# EAGLE board toyotune_3s_lvc (EAGLE 5.11)
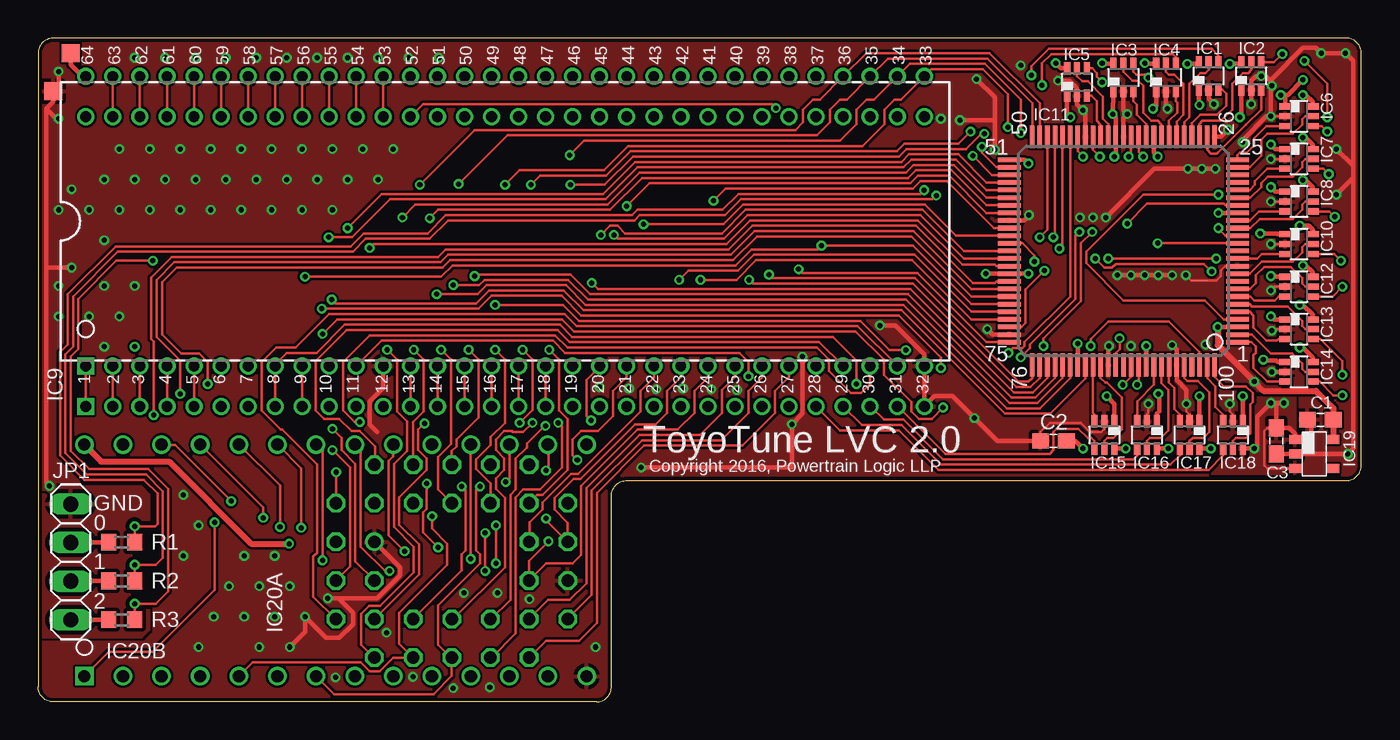
[diagram p4: board, top side]
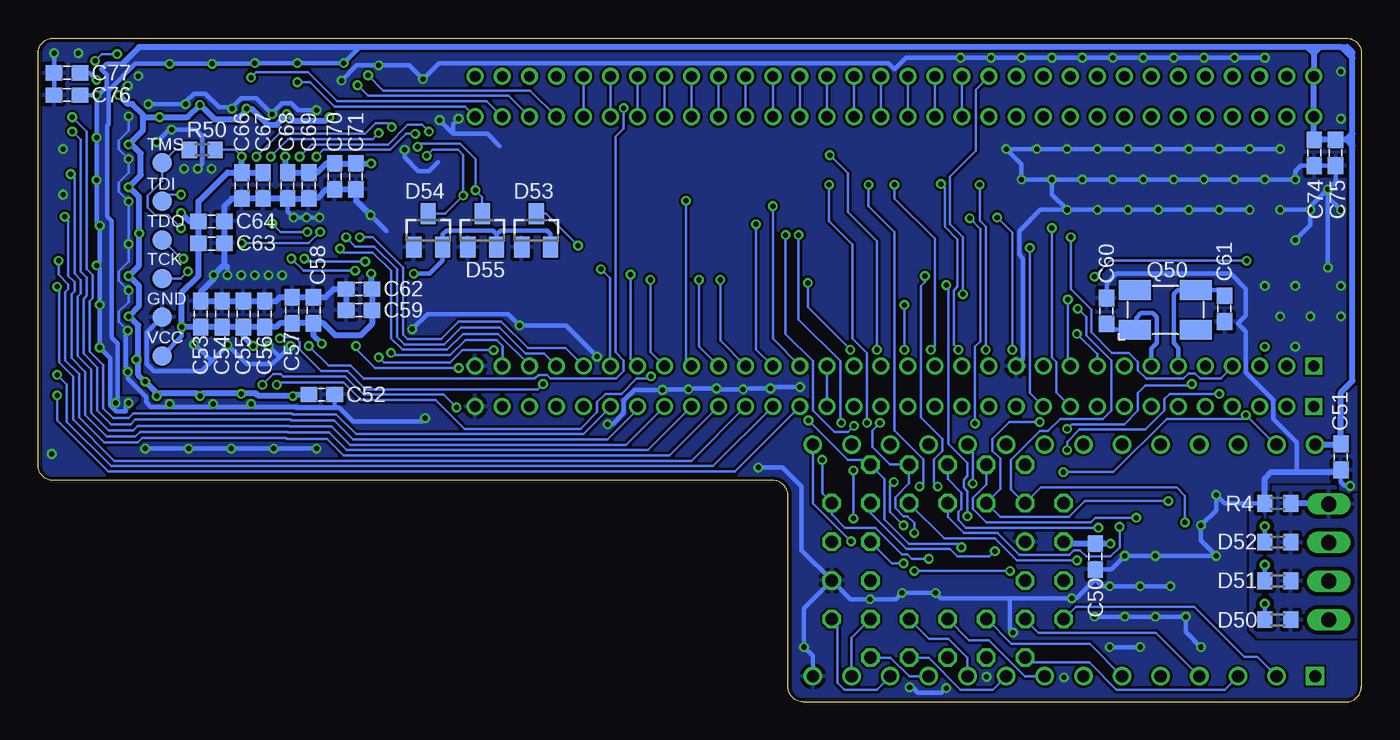
[diagram p5: board, bottom side, seen from below]

Size 87 x 43.65 mm. Coordinates in mm from the lower left corner, seen from the top.
Outline: 1.05,43.65 arc90 0,42.65 0,1 arc90 1,0 36.7,0 arc90 37.7,1 37.7,13.55 arc-90 38.7,14.55 86,14.55 arc90 87,15.55 87,42.65 arc90 86,43.65 1.05,43.65
Copper layers (1*16): Top 0.035mm / dielectric 1.5mm / Bottom 0.035mm
Design rules "pcbway": minimum track width 6mil, minimum drill 12mil, track to track 6mil, track to pad 6mil, pad to pad 6mil, via to via 6mil, smd to smd 0mil, copper to edge 10mil, drill to drill 10mil, minimum pad ring 8mil, minimum via ring 6mil, stop-mask expansion 2mil, vias tented up to drill 100mil, thermal gap 10mil

## Footprints (pad centres in the part's own frame; a part is rotated, then mirrored left to right if it is on the bottom)
C0603 = smd 1.1 x 1: 1 -0.85,0; 2 0.85,0
R0603 = smd 1 x 1.1: 1 -0.85,0; 2 0.85,0
SOT23 = smd 1 x 1.4: 1 -0.95,-1.1; 2 0.95,-1.1; 3 0,1.1
DCK_R-PDSO-G6 = smd 0.4 x 0.8: 1 -0.65,-0.9; 2 0,-0.9; 3 0.65,-0.9; 4 0.65,0.9; 5 0,0.9; 6 -0.65,0.9
SDIP-64 = drill 0.711 square: 1 -27.559,-9.525 | drill 0.711 round: 2 -25.781,-9.525; 3 -24.003,-9.525; 4 -22.225,-9.525; 5 -20.447,-9.525; 6 -18.669,-9.525; 7 -16.891,-9.525; 8 -15.113,-9.525; 9 -13.335,-9.525; 10 -11.557,-9.525; 11 -9.779,-9.525; 12 -8.001,-9.525; 13 -6.223,-9.525; 14 -4.445,-9.525; 15 -2.667,-9.525; 16 -0.889,-9.525; 17 0.889,-9.525; 18 2.667,-9.525; 19 4.445,-9.525; 20 6.223,-9.525; 21 8.001,-9.525; 22 9.779,-9.525; 23 11.557,-9.525; 24 13.335,-9.525; 25 15.113,-9.525; 26 16.891,-9.525; 27 18.669,-9.525; 28 20.447,-9.525; 29 22.225,-9.525; 30 24.003,-9.525; 31 25.781,-9.525; 32 27.559,-9.525; 33 27.559,9.525; 34 25.781,9.525; 35 24.003,9.525; 36 22.225,9.525; 37 20.447,9.525; 38 18.669,9.525; 39 16.891,9.525; 40 15.113,9.525; 41 13.335,9.525; 42 11.557,9.525; 43 9.779,9.525; 44 8.001,9.525; 45 6.223,9.525; 46 4.445,9.525; 47 2.667,9.525; 48 0.889,9.525; 49 -0.889,9.525; 50 -2.667,9.525; 51 -4.445,9.525; 52 -6.223,9.525; 53 -8.001,9.525; 54 -9.779,9.525; 55 -11.557,9.525; 56 -13.335,9.525; 57 -15.113,9.525; 58 -16.891,9.525; 59 -18.669,9.525; 60 -20.447,9.525; 61 -22.225,9.525; 62 -24.003,9.525; 63 -25.781,9.525; 64 -27.559,9.525
VQ100 = smd 1.5 x 0.3: 1 -7.5,6; 2 -7.5,5.5; 3 -7.5,5; 4 -7.5,4.5; 5 -7.5,4; 6 -7.5,3.5; 7 -7.5,3; 8 -7.5,2.5; 9 -7.5,2; 10 -7.5,1.5; 11 -7.5,1; 12 -7.5,0.5; 13 -7.5,0; 14 -7.5,-0.5; 15 -7.5,-1; 16 -7.5,-1.5; 17 -7.5,-2; 18 -7.5,-2.5; 19 -7.5,-3; 20 -7.5,-3.5; 21 -7.5,-4; 22 -7.5,-4.5; 23 -7.5,-5; 24 -7.5,-5.5; 25 -7.5,-6; 51 7.5,-6; 52 7.5,-5.5; 53 7.5,-5; 54 7.5,-4.5; 55 7.5,-4; 56 7.5,-3.5; 57 7.5,-3; 58 7.5,-2.5; 59 7.5,-2; 60 7.5,-1.5; 61 7.5,-1; 62 7.5,-0.5; 63 7.5,0; 64 7.5,0.5; 65 7.5,1; 66 7.5,1.5; 67 7.5,2; 68 7.5,2.5; 69 7.5,3; 70 7.5,3.5; 71 7.5,4; 72 7.5,4.5; 73 7.5,5; 74 7.5,5.5; 75 7.5,6 | smd 0.3 x 1.5: 26 -6,-7.5; 27 -5.5,-7.5; 28 -5,-7.5; 29 -4.5,-7.5; 30 -4,-7.5; 31 -3.5,-7.5; 32 -3,-7.5; 33 -2.5,-7.5; 34 -2,-7.5; 35 -1.5,-7.5; 36 -1,-7.5; 37 -0.5,-7.5; 38 0,-7.5; 39 0.5,-7.5; 40 1,-7.5; 41 1.5,-7.5; 42 2,-7.5; 43 2.5,-7.5; 44 3,-7.5; 45 3.5,-7.5; 46 4,-7.5; 47 4.5,-7.5; 48 5,-7.5; 49 5.5,-7.5; 50 6,-7.5; 76 6,7.5; 77 5.5,7.5; 78 5,7.5; 79 4.5,7.5; 80 4,7.5; 81 3.5,7.5; 82 3,7.5; 83 2.5,7.5; 84 2,7.5; 85 1.5,7.5; 86 1,7.5; 87 0.5,7.5; 88 0,7.5; 89 -0.5,7.5; 90 -1,7.5; 91 -1.5,7.5; 92 -2,7.5; 93 -2.5,7.5; 94 -3,7.5; 95 -3.5,7.5; 96 -4,7.5; 97 -4.5,7.5; 98 -5,7.5; 99 -5.5,7.5; 100 -6,7.5
DDC_R-PDSO-G5 = smd 0.6 x 0.8: 1 -0.95,-1.25; 2 0,-1.25; 3 0.95,-1.25; 4 0.95,1.25; 5 -0.95,1.25
S32 = drill 0.813 round: 1 1.27,5.08 | drill 0.813 octagon: 2 -1.27,7.62; 3 -1.27,5.08; 4 -3.81,7.62; 5 -6.35,5.08; 6 -3.81,5.08; 7 -6.35,2.54; 8 -3.81,2.54; 9 -6.35,0; 10 -3.81,0; 11 -6.35,-2.54; 12 -3.81,-2.54; 13 -6.35,-5.08; 14 -3.81,-7.62; 15 -3.81,-5.08; 16 -1.27,-7.62; 17 -1.27,-5.08; 18 1.27,-7.62; 19 1.27,-5.08; 20 3.81,-7.62; 21 6.35,-5.08; 22 3.81,-5.08; 23 6.35,-2.54; 24 3.81,-2.54; 25 6.35,0; 26 3.81,0; 27 6.35,2.54; 28 3.81,2.54; 29 6.35,5.08; 30 3.81,7.62; 31 3.81,5.08; 32 1.27,7.62
PDIP28 = drill 0.813 square: 1 -16.51,-7.62 | drill 0.813 round: 2 -13.97,-7.62; 3 -11.43,-7.62; 4 -8.89,-7.62; 5 -6.35,-7.62; 6 -3.81,-7.62; 7 -1.27,-7.62; 8 1.27,-7.62; 9 3.81,-7.62; 10 6.35,-7.62; 11 8.89,-7.62; 12 11.43,-7.62; 13 13.97,-7.62; 14 16.51,-7.62; 15 16.51,7.62; 16 13.97,7.62; 17 11.43,7.62; 18 8.89,7.62; 19 6.35,7.62; 20 3.81,7.62; 21 1.27,7.62; 22 -1.27,7.62; 23 -3.81,7.62; 24 -6.35,7.62; 25 -8.89,7.62; 26 -11.43,7.62; 27 -13.97,7.62; 28 -16.51,7.62
1X04 = drill 1.016 long: 1 -3.81,0; 2 -1.27,0; 3 1.27,0; 4 3.81,0
1X06_SMD = smd 1.27 x 1.27: GND 3.81,0; TCK 1.27,0; TDI -3.81,0; TDO -1.27,0; TMS -6.35,0; VCC 6.35,0
CRYSTAL-SMD-5X3 = smd 2.1 x 1.3: 1 -2,-1.3; 2 2,-1.3; 3 2,1.3; 4 -2,1.3
TP12SQ = smd 1.2 x 1.2: TP 0,0
SDIP-64-CONN = drill 0.711 square: 1 -27.559,-9.525 | drill 0.711 round: 2 -25.781,-9.525; 3 -24.003,-9.525; 4 -22.225,-9.525; 5 -20.447,-9.525; 6 -18.669,-9.525; 7 -16.891,-9.525; 8 -15.113,-9.525; 9 -13.335,-9.525; 10 -11.557,-9.525; 11 -9.779,-9.525; 12 -8.001,-9.525; 13 -6.223,-9.525; 14 -4.445,-9.525; 15 -2.667,-9.525; 16 -0.889,-9.525; 17 0.889,-9.525; 18 2.667,-9.525; 19 4.445,-9.525; 20 6.223,-9.525; 21 8.001,-9.525; 22 9.779,-9.525; 23 11.557,-9.525; 24 13.335,-9.525; 25 15.113,-9.525; 26 16.891,-9.525; 27 18.669,-9.525; 28 20.447,-9.525; 29 22.225,-9.525; 30 24.003,-9.525; 31 25.781,-9.525; 32 27.559,-9.525; 33 27.559,9.525; 34 25.781,9.525; 35 24.003,9.525; 36 22.225,9.525; 37 20.447,9.525; 38 18.669,9.525; 39 16.891,9.525; 40 15.113,9.525; 41 13.335,9.525; 42 11.557,9.525; 43 9.779,9.525; 44 8.001,9.525; 45 6.223,9.525; 46 4.445,9.525; 47 2.667,9.525; 48 0.889,9.525; 49 -0.889,9.525; 50 -2.667,9.525; 51 -4.445,9.525; 52 -6.223,9.525; 53 -8.001,9.525; 54 -9.779,9.525; 55 -11.557,9.525; 56 -13.335,9.525; 57 -15.113,9.525; 58 -16.891,9.525; 59 -18.669,9.525; 60 -20.447,9.525; 61 -22.225,9.525; 62 -24.003,9.525; 63 -25.781,9.525; 64 -27.559,9.525

## Placement (x,y rotation side)
C1  1uF  [C0603]  84.3,18.55 180 top
C2  0.1uF  [C0603]  66.75,17.15 0 top
C3  1uF  [C0603]  81.4,17.15 270 top
C50  0.1uF  [C0603]  17.5,9.55 90 bottom
C51  0.1uF  [C0603]  1.35,16.1 90 bottom
C52  0.1uF  [C0603]  68.35,20.2 180 bottom
C53  0.01uF  [C0603]  76.3,25.5 270 bottom
C54  0.1uF  [C0603]  74.9,25.5 270 bottom
C55  0.01uF  [C0603]  73.5,25.5 270 bottom
C56  0.1uF  [C0603]  72.1,25.5 270 bottom
C57  0.1uF  [C0603]  70.3,25.75 270 bottom
C58  0.01uF  [C0603]  68.9,25.75 270 bottom
C59  0.1uF  [C0603]  65.9,25.75 0 bottom
C60  10pF  [C0603]  16.75,25.7 90 bottom
C61  10pF  [C0603]  9,25.85 90 bottom
C62  0.01uF  [C0603]  65.9,27.15 0 bottom
C63  0.1uF  [C0603]  75.6,30.15 180 bottom
C64  0.01uF  [C0603]  75.6,31.6 180 bottom
C66  0.01uF  [C0603]  73.6,33.95 90 bottom
C67  0.1uF  [C0603]  72.2,33.95 90 bottom
C68  0.01uF  [C0603]  70.6,33.95 90 bottom
C69  0.1uF  [C0603]  69.2,33.95 90 bottom
C70  0.1uF  [C0603]  67.5,34.55 90 bottom
C71  0.01uF  [C0603]  66.1,34.55 90 bottom
C74  0.01uF  [C0603]  3.1,36.1 90 bottom
C75  0.1uF  [C0603]  1.7,36.1 90 bottom
C76  0.1uF  [C0603]  85.1,39.9 0 bottom
C77  0.1uF  [C0603]  85.1,41.35 0 bottom
D50  PGB1010603  [R0603]  5.5,5.4 180 bottom
D51  PGB1010603  [R0603]  5.5,7.95 180 bottom
D52  PGB1010603  [R0603]  5.5,10.5 180 bottom
D53  BAT54S  [SOT23]  54.25,31 0 bottom
D54  BAT54S  [SOT23]  61.35,31 0 bottom
D55  BAT54S  [SOT23]  57.8,31 0 bottom
IC1  SN74LVC1T45DCK  [DCK_R-PDSO-G6]  76.95,41.15 0 top
IC2  SN74LVC1T45DCK  [DCK_R-PDSO-G6]  79.75,41.15 0 top
IC3  SN74LVC1T45DCK  [DCK_R-PDSO-G6]  71.35,41.05 0 top
IC4  SN74LVC1T45DCK  [DCK_R-PDSO-G6]  74.15,41.05 0 top
IC5  SN74LVC1T45DCK  [DCK_R-PDSO-G6]  68.3,40.75 0 top
IC6  SN74LVC1T45DCK  [DCK_R-PDSO-G6]  82.9,38.5 270 top
IC7  SN74LVC1T45DCK  [DCK_R-PDSO-G6]  82.9,35.7 270 top
IC8  SN74LVC1T45DCK  [DCK_R-PDSO-G6]  82.9,32.9 270 top
IC9  D15180X-XXXX  [SDIP-64]  30.7,31.6 0 top
IC10  SN74LVC1T45DCK  [DCK_R-PDSO-G6]  82.9,30.1 270 top
IC11  XCR3128XL  [VQ100]  71.35,29.65 180 top
IC12  SN74LVC1T45DCK  [DCK_R-PDSO-G6]  82.9,27.3 270 top
IC13  SN74LVC1T45DCK  [DCK_R-PDSO-G6]  82.9,24.5 270 top
IC14  SN74LVC1T45  [DCK_R-PDSO-G6]  82.9,21.7 270 top
IC15  SN74LVC1T45DCK  [DCK_R-PDSO-G6]  70.1,17.55 180 top
IC16  SN74LVC1T45DCK  [DCK_R-PDSO-G6]  72.9,17.55 180 top
IC17  SN74LVC1T45DCK  [DCK_R-PDSO-G6]  75.7,17.55 180 top
IC18  SN74LVC1T45DCK  [DCK_R-PDSO-G6]  78.55,17.55 180 top
IC19  TLV70033  [DDC_R-PDSO-G5]  83.9,16.3 270 top
IC20A  SST39SF020WH  [S32]  27.2,9.25 90 top
IC20B  AT29C256  [PDIP28]  19.55,9.3 0 top
JP1  [1X04]  2.15,9.2 270 top
JP50  JTAG  [1X06_SMD]  78.85,29.1 270 bottom
Q50  16Mhz  [CRYSTAL-SMD-5X3]  12.89,25.77 0 bottom
R1  470R  [R0603]  5.5,10.5 180 top
R2  470R  [R0603]  5.5,7.95 180 top
R3  470R  [R0603]  5.5,5.4 180 top
R4  470R  [R0603]  5.5,13.05 180 bottom
R50  10K  [R0603]  76.2,36.3 0 bottom
TP_GND  TPSQTP12SQ  [TP12SQ]  1,40.15 0 top
TP_VCC  TPSQTP12SQ  [TP12SQ]  2.15,42.65 0 top
U1  D151803-CONN  [SDIP-64-CONN]  30.7,28.95 0 top

## Tracks (layer width: path | path; a pad name or v marks a point on that pad's centre or on a via)
!D_HALT
  Bottom 0.178: U1.51 IC9.51
!D_INIT  (via drill 0.33)
  Top 0.178: IC11.81 67.85,21.3 65.85,19.3 63.7,19.3 56.9,26.1 36,26.1 34.7,27.4 29.5,27.4 28.9,26.8 v26.2,26.8
  Bottom 0.178: v26.2,26.8 26.2,30.55 27.05,31.4 27.05,34.55 25.35,36.25 25.35,40.25 IC9.52
!D_IRL
  Top 0.178: U1.5 IC9.5
!D_IRP  (via drill 0.33)
  Top 0.178: U1.4 IC9.4 | IC11.55 62.35,33.65 60.35,35.65 57.4,35.65 56.9,35.15 39.4,35.15 37.3,33.05 23.15,33.05 20.65,30.55 v19.1,30.55
  Bottom 0.178: IC9.4 8.47,22.03 9.25,21.25 10.6,21.25 10.95,21.6 11.35,21.6 11.7,21.25 14.15,21.25 14.7,21.8 14.7,22.35 15.3,22.95 16.4,22.95 17.75,24.3 17.75,25.8 19.1,27.15 v19.1,30.55
!D_NMI
  Top 0.178: U1.3 IC9.3
!D_RD  (via drill 0.33)
  Top 0.178: IC11.83 68.85,21.25 66.55,18.95 63.55,18.95 56.75,25.75 35.85,25.75 34.55,27.05 29.65,27.05 28.8,26.2 19.55,26.2 v19.3,26.45
  Bottom 0.178: IC9.10 19.3,22.23 v19.3,26.45
!D_TEST
  Bottom 0.178: U1.49 IC9.49
!D_WDC
  Top 0.178: U1.53 IC9.53
!D_WI
  Bottom 0.178: U1.50 IC9.50
!D_WR  (via drill 0.33)
  Top 0.178: v46.7,21.4 46.7,22.35 46.1,22.95 34.65,22.95 33.85,23.75 22.6,23.75 IC9.11 | IC11.89 71.85,21.35 71.3,20.8 v71.3,20.85
  Bottom 0.178: v46.7,21.4 46.85,21.25 47.65,21.25 48.65,20.25 49.7,20.25 50.25,19.7 50.25,19.05 51.35,17.95 58.95,17.95 60.85,19.85 65.75,19.85 66.9,21 71.15,21 v71.3,20.85
!E_INIT  (via drill 0.33)
  Top 0.178: IC11.98 76.35,23 74.35,25 70.35,25 69.2,23.85 v69.2,23.4 | U1.52 25.3,39.3 48.25,39.3 v48.5,39.05
  Bottom 0.178: v69.2,23.4 67.9,22.1 66.45,22.1 65.6,21.25 54.35,21.25 54.1,21.5 53.55,21.5 53.3,21.25 49,21.25 48.5,21.75 48.5,22.45 49.05,23 49.05,37.15 48.5,37.7 v48.5,39.05
!E_IS  (via drill 0.33)
  Top 0.178: IC11.54 62.35,34.15 60.5,36 57.25,36 56.75,35.5 39.25,35.5 37.15,33.4 22.6,33.4 v20.35,31.15
  Bottom 0.178: U1.10 20.05,20.33 20.05,22.35 20.35,22.65 v20.35,31.15
!E_OS  (via drill 0.33)
  Top 0.178: IC11.65 63,28.65 62.9,28.75 60.75,28.75 57.85,31.65 46.8,31.65 45.25,30.1 22.05,30.1 v21.8,29.85
  Bottom 0.178: U1.11 21.8,20.3 v21.8,29.85
!M_RD  (via drill 0.33)
  Top 0.178: v73.6,30.15 IC11.14 | v30.05,23.15 30.7,22.5 30.7,18.35 29.75,17.4 29.75,16.9 28.8,15.95 28.8,15.3 29.74,14.36 IC20A.24 | v30.05,26.1 34.5,26.1 35.55,25.05 54.05,25.05 55.98,23.12 v57.05,23.12 | v68.45,30.9 68.2,30.65 68.2,26.5 65.2,23.5 65.2,23.25 v64.6,22.65 | IC20B.22 18.7,16.5 v18.7,9.3
  Bottom 0.178: v30.05,23.15 v30.05,26.1 | v73.6,30.15 69.2,30.15 v68.45,30.9 | v64.6,22.65 64.25,22.3 59.9,22.3 59.08,23.12 v57.05,23.12 | IC20A.24 27.43,10.75 24.1,10.75 22.65,9.3 v18.7,9.3
!M_ROM_CS  (via drill 0.33)
  Top 0.178: IC11.78 66.35,21.3 65.4,20.35 64.15,20.35 57.35,27.15 36.8,27.15 v36.4,27.55 | v33.6,23.15 34.25,22.5 34.25,19.15 34.8,18.6 34.8,15.25 33.15,13.6 32.82,13.6 IC20A.22 | IC20B.20 23.35,16.9 23.35,16.15 23.05,15.85 23.05,10.95 v24.1,9.9
  Bottom 0.178: v33.6,23.15 36.4,25.95 v36.4,27.55 | IC20A.22 32.28,12.43 29.9,10.05 27.05,10.05 26.55,9.55 24.45,9.55 v24.1,9.9
!M_WR/M_A15  (via drill 0.33)
  Top 0.178: IC11.19 78.05,32.65 77.95,32.75 72.9,32.75 v71.6,31.45 | v59.35,21.95 59.35,22.65 56.6,25.4 35.7,25.4 34.4,26.7 29.8,26.7 28.95,25.85 v18.65,25.85 | v66.1,23.4 66.1,23.9 68.55,26.35 68.55,30.15 v69.3,30.9 | v11.6,11.8 11.6,7.35 7.55,3.3 4.66,3.3 IC20B.1
  Bottom 0.178: v71.6,31.45 71.05,30.9 v69.3,30.9 | v18.65,25.85 18.1,25.3 18.1,24.1 16.45,22.45 16.45,19.15 17,18.6 19.8,18.6 20.6,17.8 21.15,17.8 23.05,15.9 23.05,13.95 22.16,13.06 IC20A.31 21.08,14.1 12.15,14.1 11.6,13.55 v11.6,11.8 | v66.1,23.4 66.1,23.2 64.85,21.95 v59.35,21.95
C_DRA0
  Top 0.178: IC11.30 75.35,38.1 75.7,38.45 75.7,40.65 76.4,41.35 76.75,41.35 76.95,41.55 IC1.5
C_DRA1
  Top 0.178: IC4.5 74.15,41.45 74.35,41.25 74.7,41.25 75.3,40.65 75.3,38.6 74.85,38.15 IC11.31
C_DRA2
  Top 0.178: IC3.5 71.35,41.45 71.95,40.85 72.3,40.85 72.65,40.5 72.65,38.75 73.2,38.2 73.6,38.2 73.85,37.95 IC11.33
C_DRA3
  Top 0.178: IC11.40 70.35,38 70,38.35 70,39.8 69,40.8 68.65,40.8 68.3,41.15 IC5.5
C_DRA4
  Top 0.178: IC15.5 70.1,17.15 70.3,17.35 70.7,17.35 71.25,17.9 71.25,20 70.25,21 70.15,21 69.85,21.3 IC11.85
C_DRA5
  Top 0.178: IC16.5 72.9,17.15 73.1,17.35 73.8,17.35 74.3,17.85 74.3,20.5 73.85,20.95 IC11.93
C_DRA6
  Top 0.178: IC17.5 75.7,17.15 75.9,17.35 76.6,17.35 77,17.75 77,20.35 76.25,21.1 75.55,21.1 75.35,21.3 IC11.96
C_DRA7
  Top 0.178: IC18.5 78.55,17.15 78.75,17.35 79.4,17.35 79.7,17.65 79.7,19.55 79.85,19.7 79.85,20.3 79.4,20.75 77.95,20.75 77.35,21.35 IC11.100
C_DRB0
  Top 0.178: IC11.28 76.35,38 76.55,38.2 77.75,38.2 78.5,38.95 78.5,40.65 79.2,41.35 79.55,41.35 79.75,41.55 IC2.5
C_DRB1
  Top 0.178: IC11.24 79.65,35.15 80.4,35.9 80.4,36.95 80.8,37.35 82.5,37.35 83.1,37.95 83.1,38.3 83.3,38.5 IC6.5
C_DRB2
  Top 0.178: IC11.20 79.7,33.15 80.4,33.85 80.4,34.1 80.85,34.55 82.5,34.55 83.1,35.15 83.1,35.5 83.3,35.7 IC7.5
C_DRB3
  Top 0.178: IC11.16 79.7,31.15 80.3,31.75 82.5,31.75 83.1,32.35 83.1,32.7 83.3,32.9 IC8.5
C_DRB4
  Top 0.178: IC11.10 79.65,28.15 80.45,28.95 82.5,28.95 83.1,29.55 83.1,29.9 83.3,30.1 IC10.5
C_DRB5
  Top 0.178: IC11.8 79.65,27.15 80.05,27.55 80.05,28.05 80.6,28.6 82.35,28.6 83.1,27.85 83.1,27.5 83.3,27.3 IC12.5
C_DRB6
  Top 0.178: IC11.6 79.65,26.15 79.8,26 82.15,26 83.1,25.05 83.1,24.7 83.3,24.5 IC13.5
C_DRB7
  Top 0.178: IC14.5 83.3,21.7 83.1,21.9 83.1,22.25 82.45,22.9 81.05,22.9 79.8,24.15 IC11.2
C_PA0
  Top 0.178: IC1.3 77.85,40.25 78.1,40 78.1,39.2 77.5,38.6 76.4,38.6 75.85,38.05 IC11.29
C_PA1
  Top 0.178: IC11.32 74.35,38.2 74.9,38.75 74.9,39.4 74.8,39.5 IC4.3
C_PA2
  Top 0.178: IC3.3 72,39.5 72.25,39.25 72.25,38.6 72.85,38 IC11.35
C_PA3
  Top 0.178: IC5.3 69.25,39.85 69.6,39.5 69.6,38.2 69.85,37.95 IC11.41
C_PA4
  Top 0.178: IC15.3 69.45,18.9 69.35,19 IC11.84
C_PA5
  Top 0.178: 73.35,22.35 IC11.92 73.35,20.85 72.25,19.75 IC16.3
C_PA6
  Top 0.178: 74.35,22.3 IC11.94 74.35,21 74.7,20.65 74.7,19.25 75.05,18.9 IC17.3
C_PA7
  Top 0.178: IC11.99 76.85,21.3 77.4,20.75 77.4,19.4 77.9,18.9 IC18.3
C_PB0
  Top 0.178: IC2.3 80.4,38.95 79.4,37.95 77.55,36.1 77.5,36.05 77.1,36.05 76.85,36.3 IC11.27
C_PB1
  Top 0.178: 78.85,35.95 | 78.85,35.95 79,36.1 79.45,36.1 79.95,36.6 79.95,37.05 80.75,37.85 IC6.3 | IC11.25 78.85,35.95
C_PB2
  Top 0.178: IC7.3 80.8,35.05 80,34.25 80,34 79.65,33.65 IC11.21
C_PB3
  Top 0.178: IC11.17 79.65,31.65 80.25,32.25 IC8.3
C_PB4
  Top 0.178: IC10.3 80.45,29.45 80.15,29.15 IC11.12
C_PB5
  Top 0.178: IC11.7 79.7,26.65 79.95,26.4 81.3,26.4 81.55,26.65 IC12.3
C_PB6
  Top 0.178: IC13.3 81.55,23.85 81.45,23.75 80.75,23.75 79.9,24.6 79.9,25.4 79.65,25.65 IC11.5
C_PB7
  Top 0.178: IC14.3 80.8,21.05 79.9,21.95 79.9,22.8 80.05,22.95 80.05,23.35 79.75,23.65 IC11.1
D1_XIN
  Bottom 0.305: IC9.6 12.03,23.28 12.35,23.6 12.35,26.8 12.08,27.07 Q50.3 9,27.07 C61.2
D1_XOUT
  Bottom 0.305: IC9.7 13.81,23.24 13.45,23.6 13.45,25.3 13.7,25.55 14.5,25.55 14.8,25.25 14.8,24.56 Q50.1 16.75,24.47 C60.1
D_A8  (via drill 0.33)
  Top 0.178: v24.7,23.15 25.35,22.5 25.35,19.1 24.65,18.4 IC20A.27 | IC11.49 65.85,39.35 62.55,42.65 54.45,42.65 IC9.36 51.4,39.6 50.95,39.6 50.3,38.95 50.3,38.1 49.8,37.6 28.7,37.6 v25.1,34 | v14.8,12.1 14.8,12.78 IC20B.25
  Bottom 0.178: v24.7,23.15 24.7,31.25 25.1,31.65 v25.1,34 | IC20A.27 24.65,14.3 25.55,13.4 25.55,12.7 24.65,11.8 17.8,11.8 17.5,12.1 v14.8,12.1
D_A9  (via drill 0.33)
  Top 0.178: v26.5,23.15 27.15,22.5 27.15,16.95 26.3,16.1 26.3,13.95 IC20A.26 | IC11.50 65.35,39.35 62.4,42.3 55.88,42.3 IC9.35 53.18,39.6 52.7,39.6 52.05,38.95 52.05,38.1 51.2,37.25 30.85,37.25 v27.65,34.05 | v15.9,11.5 15.9,14.22 IC20B.24
  Bottom 0.178: v26.5,23.15 26.8,23.45 26.8,27.05 26.55,27.3 26.55,30.4 27.4,31.25 27.4,33.8 v27.65,34.05 | IC20A.26 27.2,12.15 26.15,11.1 23.95,11.1 22.5,9.65 19.2,9.65 18.9,9.95 18.5,9.95 18.1,9.55 16.5,9.55 15.9,10.15 v15.9,11.5
D_A10  (via drill 0.33)
  Top 0.178: v31.85,23.15 32.5,22.5 32.5,19.2 v31.65,18.35 | IC11.37 71.85,36 v71.7,35.85 | v64.6,37.4 64.6,39.6 62.25,41.95 57.31,41.95 IC9.34 54.96,39.6 54.45,39.6 53.8,38.95 53.8,38 52.7,36.9 35.9,36.9 v34.95,35.95 | IC20B.21 20.84,16.9 20.85,16.9 21.2,16.55 21.2,10.2 22.8,8.6 v23.1,8.6 | v29.4,8.6 v29.4,11.1
  Bottom 0.178: v31.85,23.15 31.85,30.3 33.75,32.2 33.75,34.75 v34.95,35.95 | v71.7,35.85 70.55,37 65,37 v64.6,37.4 | v31.65,18.35 32.15,17.85 32.15,16.75 31,15.6 IC20A.23 29.75,14.35 30.65,13.45 30.65,12.75 30.1,12.2 29.85,12.2 29.4,11.75 v29.4,11.1 | v23.1,8.6 v29.4,8.6
D_A11  (via drill 0.33)
  Top 0.178: v28.3,23.15 28.95,22.5 28.95,18.7 27.5,17.25 27.5,16.8 27.2,16.5 IC20A.25 | IC11.36 72.35,36.15 v72.65,35.85 | v63.75,37.8 63.75,39.95 62.1,41.6 58.73,41.6 IC9.33 56.73,39.6 56.3,39.6 55.65,38.95 55.65,38 54.2,36.55 38.8,36.55 37.2,34.95 31.65,34.95 v30.7,34 | v17.3,11.45 17.3,15.36 IC20B.23
  Bottom 0.178: v28.3,23.15 28.05,23.4 28.05,30.45 30.7,33.1 v30.7,34 | v72.65,35.85 71.15,37.35 65.5,37.35 64.8,38.05 64,38.05 v63.75,37.8 | IC20A.25 27.2,14.65 26.3,13.75 26.3,12.7 26.5,12.5 26.5,11.95 26,11.45 v17.3,11.45
D_A12  (via drill 0.33)
  Top 0.178: IC11.45 67.85,26.65 64.85,23.65 64.85,23.4 64.7,23.25 64.1,23.25 v63.8,22.95 | IC9.31 56.48,22.1 53.88,24.7 35.4,24.7 34.6,25.5 19.15,25.5 16.95,23.3 15.65,23.3 14.7,22.35 14.7,19.15 15.95,17.9 16.05,17.9 18.35,15.6 18.35,9.8 18.1,9.55 18.1,6.9 19.56,5.44 IC20A.4
  Bottom 0.178: v63.8,22.95 63.65,22.8 59.9,22.8 58.9,23.8 56.85,23.8 56.45,23.4 56.45,22.1 IC9.31 | IC20A.4 18.77,6.25 11,6.25 7.7,2.95 6.85,2.95 IC20B.2
D_A13  (via drill 0.33)
  Top 0.178: IC11.46 67.35,30 v67.15,29.8 | v21.15,18.4 20.8,18.4 20.05,19.15 20.05,22.35 21.8,24.1 34,24.1 34.8,23.3 51.2,23.3 52,22.5 52,21.75 53.45,20.3 54.1,20.3 54.7,20.9 IC9.30 | v12.7,13.2 9,16.9 8.14,16.9 IC20B.26
  Bottom 0.178: v67.15,29.8 66.9,29.55 65,29.55 63.8,28.35 63.8,23.9 63.05,23.15 60.1,23.15 59.05,24.2 56.75,24.2 54.7,22.15 IC9.30 | v21.15,18.4 23.15,18.4 24.25,17.3 24.25,16.5 23.75,16 23.75,14 24.66,13.09 IC20A.28 23.75,12.15 19.25,12.15 18.2,13.2 v12.7,13.2
D_A14  (via drill 0.33)
  Top 0.178: v66.75,30.55 66.85,30.65 IC11.47 | IC9.29 52.93,22.1 52.9,22.1 51.35,23.65 34.95,23.65 34.15,24.45 20.3,24.45 18.25,22.4 18.25,19.15 18.8,18.6 19.8,18.6 20.6,17.8 21.15,17.8 22.15,16.8 22.15,15.63 IC20A.29
  Bottom 0.178: v66.75,30.55 66.15,29.95 64.9,29.95 63.4,28.45 63.4,24 62.9,23.5 60.3,23.5 59.2,24.6 56.65,24.6 54.95,22.9 53.75,22.9 IC9.29 | IC20A.29 22.12,15.57
D_A15  (via drill 0.33)
  Top 0.178: IC11.48 66.35,31.05 v65.85,30.55
  Bottom 0.178: v65.85,30.55 65,30.55 63,28.55 63,24.15 62.7,23.85 60.5,23.85 59.35,25 56.55,25 54.8,23.25 52.32,23.25 IC9.28
D_ADR  (via drill 0.33)
  Top 0.178: U1.9 IC9.9 | IC11.90 72.35,20.95 v72.25,20.85 | v18.7,24.2 19.65,25.15 34.45,25.15 35.25,24.35 53.75,24.35 55.6,22.5 55.6,21.5 57.4,19.7 57.4,19.1 57.9,18.6 58.75,18.6 v59.5,19.35
  Bottom 0.178: 17.35,22.09 IC9.9 17.37,22.87 v18.7,24.2 | v72.25,20.85 71.55,21.55 71.05,21.55 70.9,21.4 66.8,21.4 65.6,20.2 60.35,20.2 v59.5,19.35
D_AL0  (via drill 0.33)
  Top 0.178: IC11.64 60.85,29.15 58,32 46.65,32 45.1,30.45 38.1,30.45 v37.85,30.7 | IC20A.12 29.79,5.44 31.05,6.7 31.05,13.6 31.4,13.95 31.4,16 32.1,16.7 32.15,16.75 32.15,17 33.3,18.15 v33.35,18.15
  Bottom 0.178: v37.85,30.7 37.85,24.2 36.05,22.4 36.05,19.15 34.65,17.75 33.75,17.75 v33.35,18.15 | IC20B.10 25.9,2.9 27.15,4.15 28.45,4.15 IC20A.12
D_AL1  (via drill 0.33)
  Top 0.178: IC11.63 60.85,29.65 58.15,32.35 46.5,32.35 44.95,30.8 38.6,30.8 38.1,31.3 37.6,31.3 v37,30.7 | v34.2,18.35 34.45,18.1 34.45,15.4 33,13.95 31.9,13.95 31.4,13.45 31.4,4.5 29.8,2.9 IC20A.11
  Bottom 0.178: v37,30.7 37,25.15 34.25,22.4 34.25,18.4 v34.2,18.35 | IC20B.9 24.24,0.8 26.35,0.8 28.45,2.9 IC20A.11
D_AL2  (via drill 0.33)
  Top 0.178: v68.7,35.85 68.35,36.2 IC11.44 | IC20A.10 27.29,5.44 30.7,8.85 30.7,13.4 30.1,14 30.1,14.7 30.65,15.25 30.65,16 30.1,16.55 30.1,17.25 30.65,17.8 31.15,17.8 31.2,17.75 31.9,17.75 v32.5,18.35 | v35,34 37.25,34 39.1,35.85 56.6,35.85 57.1,36.35 61,36.35 62,37.35 v62.2,37.35
  Bottom 0.178: v68.7,35.85 68.25,36.3 63.85,36.3 62.8,37.35 v62.2,37.35 | v35,34 35,31.6 33.45,30.05 33.45,23.9 32.5,22.95 v32.5,18.35 | IC20B.8 22.13,1.68 24.5,4.05 25.81,4.05 IC20A.10
D_AL3  (via drill 0.33)
  Top 0.178: IC11.42 69.35,36.3 v69.8,35.85 | v29.05,14.15 28.8,13.9 28.8,9.95 29.05,9.7 29.05,9.1 26.3,6.35 26.3,3.75 27.15,2.9 IC20A.9 27.2,1.7 26,0.5 19.46,0.5 IC20B.7 | v32.4,34 33,34.6 37.35,34.6 38.95,36.2 56.45,36.2 56.95,36.7 60.5,36.7 v61.3,37.5
  Bottom 0.178: v32.4,34 32.4,32.6 30.7,30.9 30.7,17.85 28.8,15.95 28.8,14.4 v29.05,14.15 | v69.8,35.85 69,36.65 64,36.65 62.7,37.95 61.75,37.95 v61.3,37.5
D_AL4  (via drill 0.33)
  Top 0.178: IC11.79 66.85,21.3 65.55,20 64,20 57.2,26.8 36.3,26.8 35,28.1 28.8,28.1 v28.7,28 | v27.85,14.15 28.1,13.9 28.1,9.95 27.85,9.7 27.85,8.63 IC20A.8
  Bottom 0.178: v28.7,28 28.7,27.6 28.95,27.35 28.95,18.7 27.55,17.3 27.55,16.5 28.1,15.95 28.1,14.4 v27.85,14.15 | IC20A.8 24.64,5.44 23,3.8 17.86,3.8 IC20B.6
D_AL5  (via drill 0.33)
  Top 0.178: IC11.80 67.35,21.3 65.7,19.65 63.85,19.65 57.05,26.45 36.15,26.45 34.85,27.75 29.35,27.75 29,27.4 v27.3,27.4 | v25.9,12.2 25.9,11.4 26.9,10.4 26.9,9 23.75,5.85 23.75,3.8 IC20A.7 23.35,2.9 22.45,2 21.8,2 21.2,2.6 14.12,2.6 IC20B.5
  Bottom 0.178: v27.3,27.4 27.15,27.25 27.15,16.95 25.9,15.7 25.9,14.85 26.15,14.6 26.15,14.1 25.9,13.85 v25.9,12.2
D_AL6  (via drill 0.33)
  Top 0.178: IC11.57 62.35,32.65 60.05,34.95 57.7,34.95 57.2,34.45 39.7,34.45 37.6,32.35 26.3,32.35 v25.75,31.8 | IC20A.6 25.05,8.37 25.05,10.35 23.75,11.65 23.75,13.45 25.55,15.25 25.55,16 25,16.55 25,17.9 v25.4,18.3
  Bottom 0.178: v25.75,31.8 25.05,31.1 25.05,23.7 25.4,23.35 v25.4,18.3 | IC20A.6 21.23,4.55 13.53,4.55 IC20B.4
D_AL7  (via drill 0.33)
  Top 0.178: v22.95,23.15 23.6,22.5 23.6,19.1 24.25,18.45 24.25,16.5 23.4,15.65 23.4,11.5 24.7,10.2 24.7,8.5 22.5,6.3 21.75,6.3 21.25,5.8 21.25,3.75 22.1,2.9 IC20A.5 | IC11.56 62.35,33.15 60.2,35.3 57.55,35.3 57.05,34.8 39.55,34.8 37.45,32.7 24.8,32.7 v23.95,31.85
  Bottom 0.178: v22.95,23.15 22.95,30.85 v23.95,31.85 | IC20A.5 21.82,2.6 17.9,2.6 16.1,0.8 9,0.8 IC20B.3
D_ASR0
  Top 0.178: U1.2 IC9.2
D_ASR1
  Top 0.178: U1.1 IC9.1
D_ASR2
  Top 0.178: U1.63 IC9.63
D_ASR3
  Top 0.178: U1.62 IC9.62
D_CCLK  (via drill 0.33)
  Top 0.178: U1.8 IC9.8 15.59,22.19 16.35,22.95 18.3,22.95 20.15,24.8 34.3,24.8 35.1,24 52.25,24 53.8,22.45 v53.8,20.9 | IC11.87 70.85,22.95 71.1,23.2 v71.1,23.9
  Bottom 0.178: v71.1,23.9 71.1,24 70.15,24 69.8,23.65 69.8,23.15 68.4,21.75 66.65,21.75 65.45,20.55 54.15,20.55 v53.8,20.9
D_DA0  (via drill 0.33)
  Top 0.178: IC9.27 49.37,21.37 48.45,20.45 48.45,19 46.3,16.85 39.85,16.85 36.75,13.75 36.75,5.2 35.55,4 33.38,4 IC20A.13 | IC11.75 62.35,23.65 57.8,28.2 50.25,28.2 v50,28.45 | IC11.75 63.95,23.65 64,23.7 63.9,23.7 IC11.75
  Bottom 0.178: 49.35,22.09 IC9.27 49.4,22.11 49.4,27.85 v50,28.45 | IC20B.11 29.73,1.68 30.95,2.9 IC20A.13
D_DA1  (via drill 0.33)
  Top 0.178: IC9.26 47.59,21.34 46.7,20.45 46.7,19 44.9,17.2 39.7,17.2 36.4,13.9 36.4,7.02 IC20A.14 | IC11.76 65.35,21.3 65.1,21.05 64.45,21.05 57.65,27.85 48.3,27.85 v48.05,28.1
  Bottom 0.178: IC9.26 48.05,22.55 v48.05,28.1 | IC20A.14 34.45,5.07 34.45,1.25 34,0.8 31.86,0.8 IC20B.12
D_DA2  (via drill 0.33)
  Top 0.178: IC9.25 45.81,21.36 44.95,20.5 44.95,19 43.5,17.55 39.55,17.55 36.05,14.05 36.05,7.8 34.95,6.7 33.54,6.7 IC20A.15 | IC11.77 65.85,21.3 65.25,20.7 64.3,20.7 57.5,27.5 47,27.5 v46.75,27.75
  Bottom 0.178: IC9.25 46.75,23.01 v46.75,27.75 | IC20A.15 33.52,4.2 IC20B.13
D_DA3  (via drill 0.33)
  Top 0.178: IC9.24 44.04,21.34 43.15,20.45 43.15,19 42.05,17.9 39.4,17.9 35.7,14.2 35.7,9.65 35.15,9.1 33.4,9.1 IC20A.17 32.28,9.28 v33.55,10.55 | IC11.60 62.85,31.15 59.75,34.25 58,34.25 57.5,33.75 45.2,33.75 v44.4,32.95
  Bottom 0.178: IC9.24 44.4,22.44 v44.4,32.95 | IC20B.15 36.05,16.9 36.05,13.05 v33.55,10.55
D_DA4  (via drill 0.33)
  Top 0.178: IC9.23 42.26,21.36 41.35,20.45 41.35,19 40.6,18.25 39.25,18.25 35.65,14.65 35.2,14.65 33.95,13.4 33.95,12.65 34.82,11.78 IC20A.18 33.4,11.94 v33.4,12.05 | IC11.72 61.35,25.15 57.45,29.05 47.2,29.05 45.9,27.75 v43.55,27.75 | v33.4,15.2 33.55,15.35 33.55,16.89 IC20B.16
  Bottom 0.178: IC9.23 43.55,23.37 v43.55,27.75 | v33.4,12.05 v33.4,15.2
D_DA5  (via drill 0.33)
  Top 0.178: IC9.22 40.48,21.33 39.6,20.45 39.6,19.1 35.5,15 35.05,15 33.15,13.1 33.15,12.65 32.3,11.8 32.3,10.54 IC20A.19 | IC11.71 61.35,25.65 57.6,29.4 47.05,29.4 46,28.35 42.75,28.35 v42.15,27.75 | IC20B.17 31,16.9 31,14.7 v30.75,14.45 | v30.1,9.1 v30.1,11.6
  Bottom 0.178: IC9.22 42.15,23.75 v42.15,27.75 | v30.75,14.45 31,14.2 31,12.5 v30.1,11.6 | v30.1,9.1 30.86,9.1 IC20A.19
D_DA6  (via drill 0.33)
  Top 0.178: IC9.21 38.7,21.35 37.8,20.45 37.8,18.8 36.8,17.8 35.7,17.8 35.15,17.25 35.15,16.2 v35.45,15.9 | v39.8,31.4 45.05,31.4 46.35,32.7 58.3,32.7 60.35,30.65 IC11.61 | v28.45,9.4 28.45,16.86 28.44,16.87 IC20B.18
  Bottom 0.178: IC9.21 39.8,23.18 v39.8,31.4 | IC20A.20 | v28.45,9.4 29.55,9.4 29.85,9.7 30.2,9.7 31.95,11.45 33.95,11.45 34.82,12.32 IC20A.20 | v35.45,15.9 35.45,13.69 IC20A.20
D_DA7  (via drill 0.33)
  Top 0.178: IC11.58 62.35,32.15 59.9,34.6 57.85,34.6 57.35,34.1 40.2,34.1 v38.7,32.6 | v36.35,18.5 36.05,18.8 36.05,21.15 36.92,22.02 IC9.20 | v26.3,10.15 25.3,11.15 25.3,12.45 25.55,12.7 v25.55,14.35
  Bottom 0.178: IC9.20 36.9,22.1 38.7,23.9 v38.7,32.6 | IC20B.19 25.55,16.57 v25.55,14.35 | v36.35,18.5 33.75,15.9 32.6,15.9 32.3,15.6 IC20A.21 31.35,14.67 31.35,12 29.75,10.4 26.55,10.4 v26.3,10.15
D_DOUT0
  Top 0.178: U1.61 IC9.61
D_DOUT1
  Top 0.178: U1.60 IC9.60
D_DOUT2
  Top 0.178: U1.59 IC9.59
D_DOUT3
  Top 0.178: U1.58 IC9.58
D_DOUT4
  Top 0.178: U1.57 IC9.57
D_DOUT5
  Top 0.178: U1.56 IC9.56
D_DOUT6
  Top 0.178: U1.55 IC9.55
D_DOUT7
  Top 0.178: U1.54 IC9.54
D_PA0  (via drill 0.33)
  Top 0.178: IC1.4 77.6,42.5 77.15,42.95 66.45,42.95 65.3,41.8 v65.3,41.2
  Bottom 0.178: U1.36 54.65,40.2 64.3,40.2 v65.3,41.2
D_PA1  (via drill 0.33)
  Top 0.178: IC4.4 74.8,42.4 74.6,42.6 66.6,42.6 66,42 v66,40.55
  Bottom 0.178: U1.35 56.08,39.85 65.3,39.85 v66,40.55
D_PA2  (via drill 0.33)
  Top 0.178: IC3.4 72,41.45 72.2,41.25 72.8,41.25 v73,41.05
  Bottom 0.178: U1.34 57.51,39.5 67.35,39.5 69.25,41.4 72.65,41.4 v73,41.05
D_PA3  (via drill 0.33)
  Top 0.178: IC5.4 69.3,41.65 69.6,41.35 69.6,41.1 v69.95,40.75
  Bottom 0.178: U1.33 58.93,39.15 67.5,39.15 69.1,40.75 v69.95,40.75
D_PA4
  Top 0.178: IC15.4 69.45,17.15 69.25,17.35 69,17.35 68.4,17.95 66.95,17.95 66.75,17.75 66.75,16.55 66.5,16.3 59.65,16.3 56.52,19.43 U1.31
D_PA5
  Top 0.178: U1.30 54.73,19.42 55.6,18.55 56.9,18.55 59.5,15.95 72,15.95 72.25,16.2 IC16.4
D_PA6
  Top 0.178: U1.29 54.15,18.2 56.75,18.2 59.35,15.6 74.45,15.6 75.05,16.2 IC17.4
D_PA7
  Top 0.178: U1.28 52.72,17.85 56.6,17.85 59.2,15.25 76.95,15.25 77.9,16.2 IC18.4
D_PB0  (via drill 0.33)
  Top 0.178: IC2.4 81.25,42.05 v81.8,42.6 | v83.25,42.15 84.75,40.65 v84.75,38.45
  Bottom 0.178: v84.75,38.45 83.8,37.5 83.8,28.45 83.4,28.05 83.4,26.55 83.6,26.35 83.6,23.05 82.7,22.15 82.7,19.3 82.05,18.65 81.05,18.65 80.75,18.95 70.3,18.95 70.25,18.9 67.4,18.9 66.1,17.6 51.15,17.6 49.38,19.38 49.38,19.42 U1.27 | v83.25,42.15 82.8,42.6 v81.8,42.6
D_PB1  (via drill 0.33)
  Top 0.178: v84.75,37.5 84.4,37.85 IC6.4
  Bottom 0.178: U1.26 47.59,19.21 49.55,17.25 66.3,17.25 67.55,18.5 70.35,18.5 70.4,18.55 80.6,18.55 80.9,18.25 82.2,18.25 83.1,19.15 83.1,22 84,22.9 84,26.5 83.8,26.7 83.8,27.9 84.2,28.3 84.2,36.95 v84.75,37.5
D_PB2  (via drill 0.33)
  Top 0.178: v84.85,34.7 84.5,35.05 IC7.4
  Bottom 0.178: U1.25 48.34,16.9 66.5,16.9 67.7,18.1 70.45,18.1 70.5,18.15 80.45,18.15 80.75,17.85 82.35,17.85 83.5,19 83.5,21.85 84.4,22.75 84.4,26.65 84.2,26.85 84.2,27.75 84.6,28.15 84.6,34.45 v84.85,34.7
D_PB3  (via drill 0.33)
  Top 0.178: v85.25,31.9 84.9,32.25 IC8.4
  Bottom 0.178: U1.24 46.91,16.55 66.7,16.55 67.85,17.7 70.55,17.7 70.6,17.75 80.3,17.75 80.6,17.45 82.5,17.45 83.9,18.85 83.9,21.7 84.8,22.6 84.8,26.8 84.6,27 84.6,27.6 85,28 85,31.65 v85.25,31.9
D_PB4  (via drill 0.33)
  Top 0.178: v85.65,29 85.2,29.45 IC10.4
  Bottom 0.178: U1.23 45.48,16.2 66.9,16.2 68,17.3 70.65,17.3 70.7,17.35 80.15,17.35 80.45,17.05 82.65,17.05 84.3,18.7 84.3,21.55 85.2,22.45 85.2,26.95 85,27.15 85,27.45 85.65,28.1 v85.65,29
D_PB5  (via drill 0.33)
  Top 0.178: v85.75,27.3 85.1,26.65 IC12.4
  Bottom 0.178: U1.22 44.05,15.85 82,15.85 84.7,18.55 84.7,21.4 85.6,22.3 85.6,27.15 v85.75,27.3
D_PB6  (via drill 0.33)
  Top 0.178: IC13.4 84.3,23.85 85.75,22.4 v85.75,21.5
  Bottom 0.178: U1.21 42.63,15.5 82.2,15.5 85.1,18.4 85.1,20.85 v85.75,21.5
D_PB7  (via drill 0.33)
  Top 0.178: v85.75,20.15 85.15,20.15 84.25,21.05 IC14.4
  Bottom 0.178: U1.20 41.2,15.15 82.4,15.15 85.75,18.5 v85.75,20.15
D_PC0
  Bottom 0.178: U1.48 IC9.48
D_PC1
  Bottom 0.178: U1.47 IC9.47
D_PC2
  Bottom 0.178: U1.46 IC9.46
D_PC3
  Bottom 0.178: U1.45 IC9.45
D_PC4
  Bottom 0.178: U1.44 IC9.44
D_PC5
  Bottom 0.178: U1.43 IC9.43
D_PC6
  Bottom 0.178: U1.42 IC9.42
D_PC7
  Bottom 0.178: U1.41 IC9.41
D_PD0
  Bottom 0.178: U1.40 IC9.40
D_PD1
  Bottom 0.178: U1.39 IC9.39
D_PD2
  Bottom 0.178: U1.38 IC9.38
D_PD3
  Bottom 0.178: U1.37 IC9.37
D_SCLK
  Top 0.178: U1.13 IC9.13
  Bottom 0.178: U1.13
D_SIN0
  Top 0.178: U1.17 IC9.17
D_SIN1
  Top 0.178: U1.16 IC9.16
D_SIN2
  Top 0.178: U1.15 IC9.15
D_SIN3
  Top 0.178: U1.14 IC9.14
D_SOUT0
  Bottom 0.178: U1.19 IC9.19
D_SOUT1
  Top 0.178: U1.18 IC9.18
GND  (via drill 0.33)
  Top 0.178: v73,19.6 73,19 72.9,18.9 IC16.2 | 75.5,19.55 75.5,19.1 75.7,18.9 IC17.2 | v78.35,19.6 78.35,19.1 78.55,18.9 IC18.2 | v81.1,24.4 81.2,24.5 IC13.2 | v81.05,27.05 81.3,27.3 IC12.2 | v81.05,32.9 IC8.2 | v81.05,35.7 IC7.2 | v81.05,30.1 IC10.2 | v81.05,38.5 IC6.2 | IC11.11 78.05,28.65 77.75,28.35 77.75,28 77.45,27.7 75.8,27.7 v75.45,28.05 | IC15.2 70.1,17.95 69.9,17.75 69.15,17.75 68.55,18.35 66.5,18.35 65.9,17.75 C2.1
  Top 0.305: v81.1,21.7 IC14.2 | 75.5,19.55 v75.5,19.6 75.5,20.5 74.85,21.15 IC11.95 74.85,23.15 v74.55,23.45 | IC3.2 71.35,38.9 v71.6,38.65 71.35,38.4 IC11.38 | v74.25,39 74.15,39.1 IC4.2 | v77.3,39.3 76.95,39.65 IC1.2 | v79.75,39.3 IC2.2 79.75,40.85 80.05,41.15 v80.4,41.15 80.7,41.15 81.1,40.75 v81.1,40.5 | IC11.59 64.8,31.65 v65.15,32 | 83.7,16.3 83.7,18.3 83.45,18.3 C1.2 | C3.2 IC19.2 83.7,16.3 | 83.7,16.3 v86.1,16.3 86.45,16.65 86.45,34.4 | IC11.43 68.85,38.75 v68.7,38.9 68.3,39.3 IC5.2 68.3,40.35 67.8,40.85 v67.05,40.85 | v77.3,39.3 | v77.3,39.3 | IC11.26 77.75,37.15 v78.23,37.63 | v79.2,36.8 79.2,36.95 80.75,38.5 v81.05,38.5 | v81.05,38.5 | 86.45,35.25 86.45,42.15 v85.95,42.65 v84.35,42.65 84,43 83.15,43 81.1,40.95 v81.1,40.5 | IC11.74 62.75,24.15 v62.4,24.5 | IC9.32 U1.32 58.93,20.1 60.1,20.1 v61.55,18.65 63.05,17.15 C2.1 | IC9.32 58.25,22.1 | 62.9,38.25 v62.9,36.3 | 62.9,38.25 62.9,39.75 v61.7,40.95 | v55.35,24.75 56.35,24.75 58.26,22.84 IC9.32 | 62.9,38.25 v60.6,38.25 | IC9.12 22.7,20.65 21.8,19.75 21.8,18.25 22.3,17.75 | 0.55,39 1,39.45 TP_GND.TP 1.35,40.5 v1.35,41.45 | 0.55,28.55 0.55,39 | 0.55,28.55 v2.2,28.55 | IC11.86 70.35,23.35 v70.4,23.4 | IC20A.1 23.8,8.85 23.8,8.3 22.3,6.8 v19.05,6.8 19.75,6.8 20.7,5.85 20.7,5.1 19.8,4.2 18.95,4.2 v17.55,5.6 17.55,4.6 v16.55,3.6 | v50.25,22.7 50.25,18.95 v49.55,18.25 49.55,15.4 v39.65,15.4 | 0.55,28.55 0.55,14.4 v0.75,14.2 | 0.55,39 1.2,38.35 v1.35,38.35 | v81.1,40.5 81.05,40.45 v81.05,38.5 | 86.45,35.25 v85.35,36.35 | 86.45,35.25 86.45,34.4 | v85.35,33.35 86.4,34.4 86.45,34.4 | v77.4,35.05 v76.5,35.05 v75.6,35.05 73.4,35.05 v70.2,31.85 | v70.95,28.05 v71.85,28.05 v72.75,28.05 v73.65,28.05 v74.55,28.05
  Bottom 0.178: v78.35,19.6 78.5,19.6 | v81.1,24.4 81.7,25 81.7,25.65 81.05,26.3 v81.05,27.05 81.7,27.7 81.7,28.3 81.05,28.95 v81.05,30.1 v81.05,32.9 81.7,33.55 81.7,34.15 81.05,34.8 v81.05,35.7 81.7,36.35 81.7,36.9 81.05,37.55 v81.05,38.5 | 75.45,19.6 v75.5,19.6
  Bottom 0.279: 5.8,18.6 5.8,19.85 7.6,21.65
  Bottom 0.305: v75.5,19.6 75.7,19.4 78.15,19.4 v78.35,19.6 78.55,19.4 79.6,19.4 79.9,19.7 79.9,20.05 81.1,21.25 v81.1,21.7 81.25,21.85 81.25,24.25 v81.1,24.4 | 70,19.4 69.95,19.35 70,19.4 | 70,19.4 72.8,19.4 v73,19.6 73.2,19.4 75.25,19.4 75.45,19.6 | 70,19.4 | 74.25,39.1 73.65,39.7 | 73.65,39.7 | 73.65,39.7 72.65,39.7 v71.6,38.65 71.6,38.7 70.95,39.35 70.35,39.35 69.9,38.9 v68.7,38.9 | v79.75,39.3 v77.3,39.3 77.3,39.45 76.75,40 76,40 | 71.12,22.68 71.6,22.2 73.3,22.2 v74.55,23.45 75.6,22.4 | 71.12,22.68 v70.4,23.4 | 70,19.4 70,19.35 67.5,19.35 | v81.05,38.5 81.25,38.5 | 76,40 | 74.25,39.1 75.1,39.1 76,40 | 76,40 | 74.25,39.1 v74.25,39 | v74.25,39 | v62.4,24.5 61.4,25.5 56.1,25.5 v55.35,24.75 52.3,24.75 v50.25,22.7 | JP50.GND 79.85,24.29 79.85,22.2 79.4,21.75 76.25,21.75 75.6,22.4 | v85.95,42.65 C77.1 C76.1 | 67.5,19.35 67.2,19.35 66.3,18.45 61.73,18.45 61.73,18.47 v61.55,18.65 | v67.05,40.85 66.05,41.85 v64.6,41.85 62.6,41.85 v61.7,40.95 60.65,42 31.1,42 30.7,41.6 29.95,42.35 v26.35,42.35 v24.35,42.35 v22.35,42.35 v20.35,42.35 v18.35,42.35 v16.35,42.35 v14.35,42.35 v12.35,42.35 v10.35,42.35 v8.35,42.35 v6.35,42.35 | C60.2 16.75,27.5 16.1,28.15 8.6,28.15 7.6,27.15 7.6,25.4 8.13,24.87 7.6,24.34 7.6,21.65 | v2.2,28.55 v2.2,33.7 | v2.2,33.7 1.7,34.2 C75.1 C74.1 4,35.25 4.35,34.9 v4.35,34.35 v6.35,34.35 v8.35,34.35 v10.35,34.35 v12.35,34.35 v14.35,34.35 v16.35,34.35 v18.35,34.35 v20.35,34.35 | 67.5,19.35 C52.1 | v36.9,20.7 38.75,20.7 v38.85,20.6 40.6,20.6 v40.65,20.55 42.35,20.55 v42.4,20.6 44.2,20.6 v44.25,20.55 45.9,20.55 v45.95,20.5 47.8,20.5 48.5,19.8 48.5,19 49.25,18.25 v49.55,18.25
  Bottom 0.305: v76.75,23.5 76.7,23.5 75.6,22.4 | 71.12,22.68 v71.85,23.4 | 17.5,8.05 C50.1 16.45,8.7 v15.55,9.6 v13.55,9.6 v9.55,9.6 10.55,10.6 v10.55,11.6 9.55,12.6 v9.55,13.6 9,13.05 R4.2 | 17.5,8.05 18.75,6.8 v19.05,6.8 23.1,6.8 | v62.9,36.3 62.9,35.8 62,34.9 61.3,34.9 60.7,35.5 | 5.8,18.6 4.25,17.05 4.25,15.1 | v65.15,32 64.1,30.95 | v39.65,15.4 38.05,15.4 36.8,14.15 36.8,9.96 IC20A.16 | IC20B.14 36.06,3.01 v36.65,3.6 36.65,6.15 IC20A.16 | v22.9,4.55 23.1,4.75 23.1,6.8 | v27.3,0.9 27.6,0.6 29.15,0.6 29.5,0.95 v29.7,0.95 | 23.1,6.8 27.65,6.8 v28,7.15 v30.2,7.15 30.6,6.75 v32.3,6.75 33.59,6.75 IC20A.16 | v12.55,7.6 v14.55,7.6 v16.55,7.6 17.05,7.6 17.5,8.05 | v10.55,3.6 11.55,4.6 v11.55,5.6 v13.55,5.6 v15.55,5.6 v17.55,5.6 | v16.55,3.6 v14.55,3.6 | v0.75,14.2 1.1,14.2 1.35,14.45 C51.1 | IC9.12 22.25,22.52 22.25,29.15 22.5,29.4 22.5,30.95 21.1,32.35 v19.35,32.35 | v5.35,36.35 v7.35,36.35 v9.35,36.35 v11.35,36.35 v13.35,36.35 v15.35,36.35 v17.35,36.35 v19.35,36.35 v21.35,36.35 v23.35,36.35 22.35,35.35 v22.35,34.35 v20.35,34.35 | v20.35,34.35 20.35,33.35 v19.35,32.35 | v19.35,32.35 v17.35,32.35 v15.35,32.35 v13.35,32.35 v11.35,32.35 v9.35,32.35 v7.35,32.35 | v3.35,32.35 v5.35,32.35 | v4.35,30.35 3.35,31.35 v3.35,32.35 | v2.2,33.7 3.35,32.55 v3.35,32.35 | v1.35,32.35 2.2,33.2 v2.2,33.7 | 56.65,36.55 57.45,37.35 59.7,37.35 | v60.6,38.25 59.7,37.35 | 59.7,37.35 59.7,38 v59.35,38.35 | 74.85,28.65 74.55,28.65 v74.55,28.05 | v76.5,35.05 76.2,35.35 76.2,37.2 76.63,37.63 v78.23,37.63 78.37,37.63 v79.2,36.8 | C68.1 70.6,32.25 v70.2,31.85 v69.35,31.85 v68.5,31.85
  Bottom 0.406: C59.1 C62.1 67.55,27.15 68.1,26.6 C58.1 C57.1 71.1,26.6 71.35,26.35 C56.1 C55.1 C54.1 C53.1 76.3,26.95 75.45,27.8 v75.45,28.05 74.85,28.65 74.75,28.65 C63.1 C64.1 74.75,32.6 74.25,33.1 C66.1 C67.1 C68.1 C69.1 69.15,33.15 68.6,33.15 68.05,33.7 C70.1 C71.1 66.1,32.95 v65.15,32 | R4.2 6.35,14.7 5.95,15.1 4.25,15.1 1.25,15.1
  other vias: 1.35,27.35 1.35,25.35 4.35,27.35 3.35,25.35 6.35,27.35 5.35,25.35 4.35,23.35 24.65,1.65 19.55,1.6
  pour Top (isolate 0.152, rank 2): -1.45,44.7 87.8,44.7 87.85,-2.6 -1.45,-2.6
  pour Bottom (isolate 0.152, rank 2): -1.45,44.7 87.8,44.7 87.8,-2.6 -1.45,-2.6
GND6  (via drill 0.33)
  other vias: 6.35,23.35
M_A15  (via drill 0.33)
  Top 0.178: IC11.69 61.35,26.65 57.4,30.6 47.25,30.6 45.7,29.05 27.1,29.05 26.6,28.55 9.1,28.55 8.15,27.6 8.15,24.15 9.4,22.9 10.6,22.9 11.15,22.35 v11.15,20.9 | v19.35,17.95 19.95,17.35 19.95,16.55 20.85,15.65 20.85,9.25 IC20A.3
  Bottom 0.178: v11.15,20.9 11.25,20.8 14.2,20.8 14.7,20.3 14.7,19.15 15.6,18.25 19.05,18.25 v19.35,17.95
M_A16  (via drill 0.33)
  Top 0.178: IC11.68 61.35,27.15 57.55,30.95 47.1,30.95 45.55,29.4 26.95,29.4 26.45,28.9 8.95,28.9 7.8,27.75 7.8,24 9.35,22.45 v9.35,20.25 | IC20A.2 20.5,8.9 20.5,15.4 v19.35,16.55
  Bottom 0.178: v9.35,20.25 12.6,20.25 12.95,19.9 12.95,19.15 14.2,17.9 18.55,17.9 19.35,17.1 v19.35,16.55
M_A17/M_A14  (via drill 0.33)
  Top 0.178: IC11.67 63,27.65 62.9,27.55 61.45,27.55 57.7,31.3 46.95,31.3 45.4,29.75 26.8,29.75 26.3,29.25 8.8,29.25 7.45,27.9 7.45,23.85 7.6,23.7 v7.6,18.85 | IC20A.30 19.6,13.08 v19.6,15.1
  Bottom 0.178: v19.6,15.1 16.3,15.1 12.8,18.6 7.85,18.6 v7.6,18.85 5.67,16.92 IC20B.27
MSEL0  (via drill 0.33)
  Top 0.178: IC11.52 63,35.15 62.05,36.1 v62.05,36.5 | D52.2 v6.35,11.55 7.7,11.55 7.85,11.7 7.85,13.7 6.95,14.6 3.05,14.6 1.45,16.2 1.45,23 1.95,23.5 1.95,26.8 5.1,29.95 20.55,29.95 21.4,30.8 25.6,30.8 26.8,32 39.05,32 39.4,32.35 45,32.35 46.05,33.4 58,33.4 v58.25,33.65
  Bottom 0.178: v62.05,36.5 61.85,36.7 59.25,36.7 58.25,35.7 v58.25,33.65 | v58.25,33.65 58.1,33.8 | v58.25,33.65 57.8,33.2 D55.3
  Bottom 0.305: v6.35,11.55 D52.2
MSEL0_ECU
  Top 0.305: R1.2 2.18,10.5 JP1.2
MSEL1  (via drill 0.33)
  Top 0.178: IC11.53 62.7,34.65 v61.45,35.9 | v59.05,33.3 58.8,33.05 46.2,33.05 45.15,32 39.55,32 39.2,31.65 26.95,31.65 25.75,30.45 21.55,30.45 20.7,29.6 5.25,29.6 2.3,26.65 2.3,23.35 1.8,22.85 1.8,16.35 3.2,14.95 7.1,14.95 8.2,13.85 8.2,9.45 7.75,9 v6.35,9 D51.2
  Bottom 0.178: v61.45,35.9 61.05,36.3 59.4,36.3 59.05,35.95 v59.05,33.3 60.25,32.1 D54.3
  Bottom 0.305: D51.2 v6.35,9
MSEL1_ECU
  Top 0.305: R2.2 2.17,7.95 JP1.3
MSEL2  (via drill 0.33)
  Top 0.178: IC11.70 61.35,26.15 57.5,30 v51.5,30 51.25,29.75 46.9,29.75 45.85,28.7 27.25,28.7 26.5,27.95 v17.55,27.95 | D50.2 v6.35,6.45 7.75,6.45 8.55,7.25 8.55,14 7.25,15.3 3.35,15.3 2.15,16.5 2.15,22.7 2.65,23.2 2.65,26.5 5.15,29 v7.55,29
  Bottom 0.178: v7.55,29 16.5,29 v17.55,27.95 | D53.3 53.6,32.1 v51.5,30
  Bottom 0.305: D50.2 v6.35,6.45
MSEL2_ECU
  Top 0.305: R3.2 JP1.4
SGND
  Bottom 0.406: R4.1 2.15,13.05 JP1.1
  pour Top (isolate 0.254): 0.05,14.15 6.8,14.15 7.3,13.65 7.3,4.75 6.8,4.25 0.1,4.25
  pour Bottom (isolate 0.254): 0.05,14.15 6.8,14.15 7.3,13.65 7.3,4.75 6.8,4.25 0.1,4.25
TCK  (via drill 0.33)
  Top 0.178: IC11.62 64.7,30.15 65.5,29.35 v65.5,28.95 | v69.5,29.15 70.1,28.55 70.6,28.55 70.85,28.8 76.65,28.8 v77.15,28.3
  Bottom 0.178: JP50.TCK 77.62,27.83 v77.15,28.3 | v65.5,28.95 69.3,28.95 v69.5,29.15
TDI  (via drill 0.33)
  Top 0.178: IC11.4 77.95,25.15 76.7,26.4 71.35,26.4 68.9,28.85 68.9,29.6 72.65,33.35 v77.6,33.35
  Bottom 0.178: v77.6,33.35 78.35,33.35 78.85,32.85 JP50.TDI
TDO  (via drill 0.33)
  Top 0.178: IC11.73 64.65,24.65 64.9,24.9 64.9,27.1 v66.15,28.35 | v70.35,29.15 v77.45,29.15
  Bottom 0.178: v77.45,29.15 77.6,29.15 78.82,30.37 JP50.TDO | v70.35,29.15 69.55,28.35 v66.15,28.35
TMS  (via drill 0.33)
  Top 0.178: IC11.15 78.05,30.65 77.6,31.1 v77.6,31.15
  Bottom 0.178: v77.6,31.15 78.45,32 79.3,32 79.8,32.5 79.8,33.3 78.85,34.25 JP50.TMS 78,36.3 R50.1
VCC  (via drill 0.33)
  Top 0.178: IC19.3 80.8,15.35 80.6,15.55 80.6,17.8 80.8,18 C3.1
  Top 0.305: TP_VCC.TP 2.15,41.9 2.9,41.15 3.17,41.15 IC9.64 | IC19.1 82.65,17.6 82.25,18 C3.1 81.4,19.65 | 81.4,19.65 v81.9,19.65 | v71.5,16.65 IC15.6 | v74.3,16.65 IC16.6 | IC18.6 v79.95,16.65 80.15,16.85 80.15,18.75 v81.05,19.65 81.4,19.65 | v77.1,16.65 IC17.6 | IC14.6 83.8,22.65 83.15,23.3 v82.95,23.3 | v82.95,26.1 83.15,26.1 83.8,25.45 IC13.6 | v83.15,28.7 83.35,28.7 83.8,28.25 IC12.6 | v82.95,31.3 83.55,31.3 83.8,31.05 IC10.6 | v83.15,34.3 83.35,34.3 83.8,33.85 IC8.6 | v83.15,37.1 83.35,37.1 83.8,36.65 IC7.6 | v83.15,39.9 83.35,39.9 83.8,39.45 IC6.6 | v78.35,41.95 79.1,41.95 IC2.6 | v75.55,41.95 76.3,41.95 IC1.6 | v66.9,42 67.25,41.65 IC5.6 | v68.7,16.65 68.2,17.15 C2.2 | IC3.6 70,41.95 v69.95,42 | IC4.6 72.8,41.95 v72.75,42
  Top 0.406: v16.5,10.4 14.01,10.4 8.61,15.8 4.15,15.8 IC20B.28
  Bottom 0.305: v81.9,19.65 81.75,19.65 81.75,23.55 82.15,23.95 82.15,31.6 82.45,31.9 82.45,37.9 82.35,38 82.35,40.2 80.6,41.95 v78.35,41.95 v75.55,41.95 72.85,41.95 | 81.45,41.95 82.5,41.95 82.85,41.6 82.5,41.25 82.5,40.45 83.05,39.9 v83.15,39.9 | IC9.64 3.15,41.13 | v79.95,16.65 v77.1,16.65 v74.3,16.65 v71.5,16.65 v68.7,16.65 | v83.15,39.9 v83.15,37.1 v83.15,34.3 83.15,31.5 v82.95,31.3 82.95,28.9 v83.15,28.7 82.95,28.5 v82.95,26.1 v82.95,23.3 82.25,22.6 82.25,19.5 81.85,19.1 81.25,19.1 81.25,19.45 v81.05,19.65 | v72.75,42 v69.95,42 v66.9,42 65.85,43.05 | v83.15,39.9 C76.2
  Bottom 0.406: IC9.64 U1.64 3.14,36.95 C74.2 C75.2 1,36.95 | 3.15,43.05 3.55,43.05 | 3.55,43.05 65.85,43.05 80.35,43.05 81.45,41.95 | 0.6,36.55 0.6,37.35 | 0.6,37.35 0.6,42.35 | 0.6,42.35 1.3,43.05 | 1.3,43.05 2.75,43.05 | 2.75,43.05 3.15,43.05 | 0.6,36.55 1,36.95 | 0.6,37.35 1,36.95 | 0.6,42.35 0.6,42.7 0.95,43.05 1.3,43.05 | 3.15,43.05 3.15,42.65 | 3.15,42.65 3.15,41.13 | 3.15,42.65 3.55,43.05 | 2.75,43.05 3.15,42.65 | 0.6,36.55 0.6,21.1 1.35,20.35 C51.2 1.38,16.92 IC20B.28 | v16.5,10.4 C50.2 19.46,10.4 IC20A.32
  pour Top: 80.05,20 82.65,20 82.65,15 76.75,15 78.45,16.75 80.05,16.75
  pour Bottom: 82.3,20.2 82.3,19.5 81.85,19.05 81.2,19.05 80.45,19.8 80.45,19.95 80.5,20 81.75,20
  pour Bottom: 67.1,16.05 67.1,17.25 70.7,17.25 71.1,17.3 80.1,17.3 80.5,16.9 82.6,16.95 82.6,16.55 82.1,16.05
  pour Bottom: 65.9,43.1 66.95,42.05 72.75,42.05 72.85,41.95 80.5,41.95 82.35,40.1 82.35,38 82.45,37.9 82.45,31.9 82.15,31.6 82.15,23.9 81.75,23.5 81.75,20 82.25,20 82.25,22.6 82.95,23.3 82.95,31.3 83.15,31.5 83.15,39.85 82.5,40.45 82.5,41.25 82.85,41.6 82.45,42 81.45,42 80.35,43.1
VCC_CPLD  (via drill 0.33)
  Top 0.305: v65.1,35.4 64.85,35.65 IC11.51 | v70.75,35.85 70.85,35.95 IC11.39 70.85,38.45 v70.65,38.65 70.65,39.35 70.7,39.4 | v73.6,35.85 73.35,36.1 IC11.34 | v77.6,32.15 IC11.18 | v72.85,23.4 IC11.91 | v68.35,23.55 IC11.82 | v65.1,28.15 IC11.66 v62.3,28.15 | IC15.1 70.75,19.6 v70.25,20.1 | IC16.1 73.55,18.95 73.7,19.1 73.7,20.2 v73.65,20.25 | v76.35,20.1 IC17.1 | v79.2,20.1 IC18.1 | v80.55,22.5 80.6,22.45 81.4,22.45 81.5,22.35 IC14.1 | v81.05,25.35 81.25,25.15 IC13.1 | v81.05,28 81.1,27.95 IC12.1 | v81.05,33.85 81.35,33.55 IC8.1 | v81.05,36.65 81.35,36.35 IC7.1 | v80.35,30.8 81.45,30.8 81.5,30.75 IC10.1 | v73.3,39 73.5,39.2 IC4.1 | v79,38.45 79.1,38.55 IC2.1 | v67.85,38.45 67.65,38.65 IC5.1 | IC1.1 76.3,39.3 v76.35,39.25 | 82,39.9 IC6.1 | 70.7,39.4 | 70.7,39.4 IC3.1 | v77.55,24.65 IC11.3 | v81.7,39.9 82,39.9 | 82,39.9 82.15,39.9 v83.15,40.9
  Top 0.406: IC19.5 C1.1 85.15,19.3 84,20.45 80.55,20.45 v79.95,21.05 77.55,23.45 v77.55,24.65
  Bottom 0.178: v73.6,35.85 74.05,36.3 R50.2
  Bottom 0.305: 70.25,20.15 v70.25,20.1 70.15,20.2 | 81,25.35 v81.05,25.35 | 79.2,20.05 v79.2,20.1 79.2,20.3 | 81,28 v81.05,28 | 81,33.85 v81.05,33.85 | 70.65,38.6 v70.65,38.65 | 80.1,38.45 80.1,38.6 | 73.3,38.9 v73.3,39 | JP50.VCC 77.55,24.05 v77.55,24.65 | v83.15,40.9 83.6,41.35 C77.2 | v73.65,20.25 73.6,20.3 | D53.2 53.3,30.75 53.55,31 56.6,31 56.85,30.75 | v62.3,28.15 61.25,28.15 60.4,29 D54.2 60.4,30.75 60.15,31 57.1,31 56.85,30.75 | 56.85,30.75 D55.2 | 73.9,38.3 | v76.35,39.25
  Bottom 0.406: 70.25,20.15 72.55,20.15 72.7,20.3 73.6,20.3 | v79.2,20.1 79,20.3 76.55,20.3 v76.35,20.1 76.15,20.3 73.7,20.3 v73.65,20.25 | 81,25.35 80.4,24.75 80.4,22.65 v80.55,22.5 80.4,22.35 80.4,21.5 v79.95,21.05 79.2,20.3 | v81.05,25.35 80.35,26.05 80.35,27.35 81,28 | v81.05,28 80.35,28.7 v80.35,30.8 80.35,33.2 81,33.85 | v81.05,33.85 80.25,34.65 80.25,36.05 80.85,36.65 v81.05,36.65 80.1,37.6 80.1,38.45 v79,38.45 77.15,38.45 v76.35,39.25 75.4,38.3 73.9,38.3 73.3,38.9 | v70.65,38.65 70.2,38.2 68.1,38.2 v67.85,38.45 | v73.3,39 72.95,39 71.9,37.95 71.3,37.95 70.65,38.6 | 70.15,20.2 C52.2 | v77.6,32.15 77.05,31.6 C64.2 | C64.2 C63.2 76.45,28 77.55,26.9 v77.55,24.65 C53.2 C54.2 C55.2 | C66.2 74.55,34.8 76.45,32.9 C64.2 | C66.2 C67.2 | C66.2 v73.6,35.85 | v70.75,35.85 70.75,34.8 C68.2 C69.2 68.65,34.8 68.05,35.4 C70.2 C71.2 v65.1,35.4 | v72.85,23.4 73.5,24.05 C55.2 | C55.2 C56.2 71.35,24.65 71.1,24.9 C57.2 C58.2 | v68.35,23.55 68.9,24.1 C58.2 | C58.2 68.25,24.9 67.45,24.1 65.8,24.1 65.05,24.85 C59.2 C62.2 65.1,27.2 v65.1,28.15 | 79.2,20.3 | 80.1,38.6 80.8,39.3 81.1,39.3 v81.7,39.9
  pour Top (no thermals): 77.5,22.85 78.2,23.55 79.7,23.55 79.9,23.35 79.9,22.95 79.6,22.65 79.6,22.05 80.7,20.95 81.6,20.95 81.6,20.45 79.8,20.45 79.4,20.85 77.95,20.85 77.5,21.3

## Text on the board
tPlace: ToyoTune LVC 2.0 | Copyright 2016, Powertrain Logic LLP | GND | 0 | 1 | 2
bPlace: TMS | TDI | TDO | TCK | GND | VCC